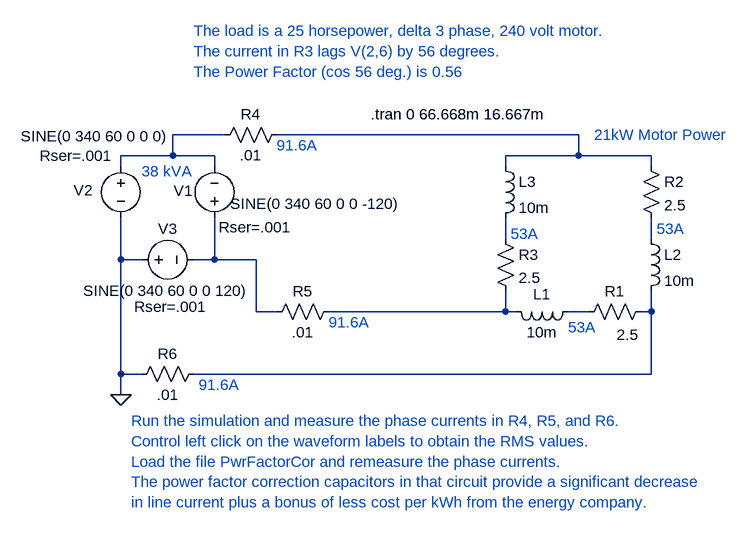
[diagram p0: schematic 3PhaseMotor.asc]
3PhaseMotor.asc, the LTspice schematic file:
Version 4
SHEET 1 880 680
WIRE -336 -176 -416 -176
WIRE 208 -176 -256 -176
WIRE -416 -144 -416 -176
WIRE -416 -144 -496 -144
WIRE -352 -144 -416 -144
WIRE 208 -144 208 -176
WIRE 208 -144 96 -144
WIRE 320 -144 208 -144
WIRE -496 -128 -496 -144
WIRE -352 -128 -352 -144
WIRE 96 -128 96 -144
WIRE 320 -128 320 -144
WIRE 96 -16 96 -48
WIRE 320 -16 320 -48
WIRE -496 16 -496 -48
WIRE -464 16 -496 16
WIRE -352 16 -352 -48
WIRE -352 16 -384 16
WIRE -288 16 -352 16
WIRE -288 96 -288 16
WIRE -256 96 -288 96
WIRE 96 96 96 64
WIRE 96 96 -176 96
WIRE 112 96 96 96
WIRE 224 96 192 96
WIRE 320 96 320 64
WIRE 320 96 304 96
WIRE -496 192 -496 16
WIRE -464 192 -496 192
WIRE 320 192 320 96
WIRE 320 192 -384 192
WIRE -496 224 -496 192
FLAG -496 224 0
SYMBOL voltage -496 -144 R0
WINDOW 0 81 54 Left 0
WINDOW 3 -154 -30 Left 0
WINDOW 123 0 0 Left 0
WINDOW 39 -125 0 Left 0
SYMATTR InstName V1
SYMATTR Value SINE(0 340 60 0 0 0)
SYMATTR SpiceLine Rser=.001
SYMBOL voltage -352 -32 R180
WINDOW 0 187 59 Left 0
WINDOW 3 -287 38 Left 0
WINDOW 123 0 0 Left 0
WINDOW 39 -119 2 Left 0
SYMATTR InstName V2
SYMATTR Value SINE(0 340 60 0 0 -120)
SYMATTR SpiceLine Rser=.001
SYMBOL voltage -480 16 R270
WINDOW 0 32 56 VTop 0
WINDOW 3 -32 53 VBottom 0
WINDOW 123 0 0 Left 0
WINDOW 39 -88 61 VTop 0
SYMATTR InstName V3
SYMATTR Value SINE(0 340 60 0 0 120)
SYMATTR SpiceLine Rser=.001
SYMBOL res 320 80 R90
WINDOW 0 0 56 VBottom 0
WINDOW 3 36 36 VTop 0
SYMATTR InstName R1
SYMATTR Value 2.5
SYMBOL ind 208 80 R90
WINDOW 0 5 56 VBottom 0
WINDOW 3 32 56 VTop 0
SYMATTR InstName L1
SYMATTR Value 10m
SYMBOL res 304 -144 R0
SYMATTR InstName R2
SYMATTR Value 2.5
SYMBOL ind 304 -32 R0
SYMATTR InstName L2
SYMATTR Value 10m
SYMBOL res 80 -32 R0
SYMATTR InstName R3
SYMATTR Value 2.5
SYMBOL ind 80 -144 R0
SYMATTR InstName L3
SYMATTR Value 10m
SYMBOL res -240 -192 R90
WINDOW 0 0 56 VBottom 0
WINDOW 3 32 56 VTop 0
SYMATTR InstName R4
SYMATTR Value .01
SYMBOL res -160 80 R90
WINDOW 0 0 56 VBottom 0
WINDOW 3 32 56 VTop 0
SYMATTR InstName R5
SYMATTR Value .01
SYMBOL res -368 176 R90
WINDOW 0 0 56 VBottom 0
WINDOW 3 32 56 VTop 0
SYMATTR InstName R6
SYMATTR Value .01
TEXT -112 -208 Left 0 !.tran 0 66.668m 16.667m
TEXT -480 264 Left 0 ;Run the simulation and measure the phase currents in R4, R5, and R6.\nControl left click on the waveform labels to obtain the RMS values.\nLoad the file PwrFactorCor and remeasure the phase currents.\nThe power factor correction capacitors in that circuit provide a significant decrease\nin line current plus a bonus of less cost per kWh from the energy company.
TEXT -376 208 Left 0 ;91.6A
TEXT -256 -160 Left 0 ;91.6A
TEXT -176 112 Left 0 ;91.6A
TEXT 104 -24 Left 0 ;53A
TEXT 328 -32 Left 0 ;53A
TEXT 192 120 Left 0 ;53A
TEXT 232 -176 Left 0 ;21kW Motor Power
TEXT -464 -120 Left 0 ;38 kVA
TEXT -384 -336 Left 0 ;The load is a 25 horsepower, delta 3 phase, 240 volt motor.\nThe current in R3 lags V(2,6) by 56 degrees.\nThe Power Factor (cos 56 deg.) is 0.56

The netlist it stands for:
* 3PhaseMotor.asc
V1 N001 0 SINE(0 340 60 0 0 0) Rser=.001
V2 N005 N001 SINE(0 340 60 0 0 -120) Rser=.001
V3 0 N005 SINE(0 340 60 0 0 120) Rser=.001
R1 N008 N007 2.5
L1 N007 N006 10m
R2 N002 N004 2.5
L2 N004 N008 10m
R3 N003 N006 2.5
L3 N002 N003 10m
R4 N002 N001 .01
R5 N006 N005 .01
R6 N008 0 .01
.tran 0 66.668m 16.667m
* Run the simulation and measure the phase currents in R4, R5, and R6.
* Control left click on the waveform labels to obtain the RMS values.
* Load the file PwrFactorCor and remeasure the phase currents.
* The power factor correction capacitors in that circuit provide a significant decrease
* in line current plus a bonus of less cost per kWh from the energy company.
* 91.6A
* 91.6A
* 91.6A
* 53A
* 53A
* 53A
* 21kW Motor Power
* 38 kVA
* The load is a 25 horsepower, delta 3 phase, 240 volt motor.
* The current in R3 lags V(2,6) by 56 degrees.
* The Power Factor (cos 56 deg.) is 0.56
.backanno
.end